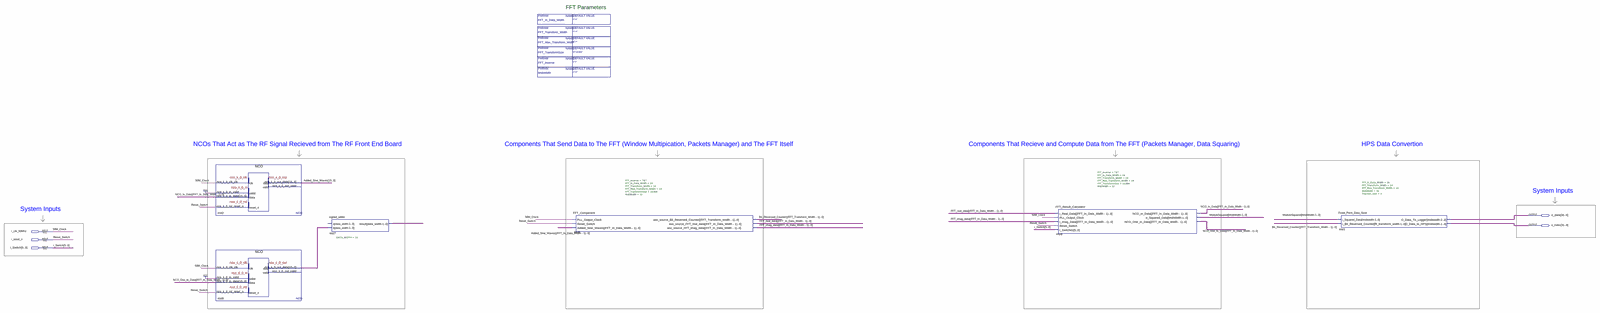
[diagram p0: schematic sheet, whole]
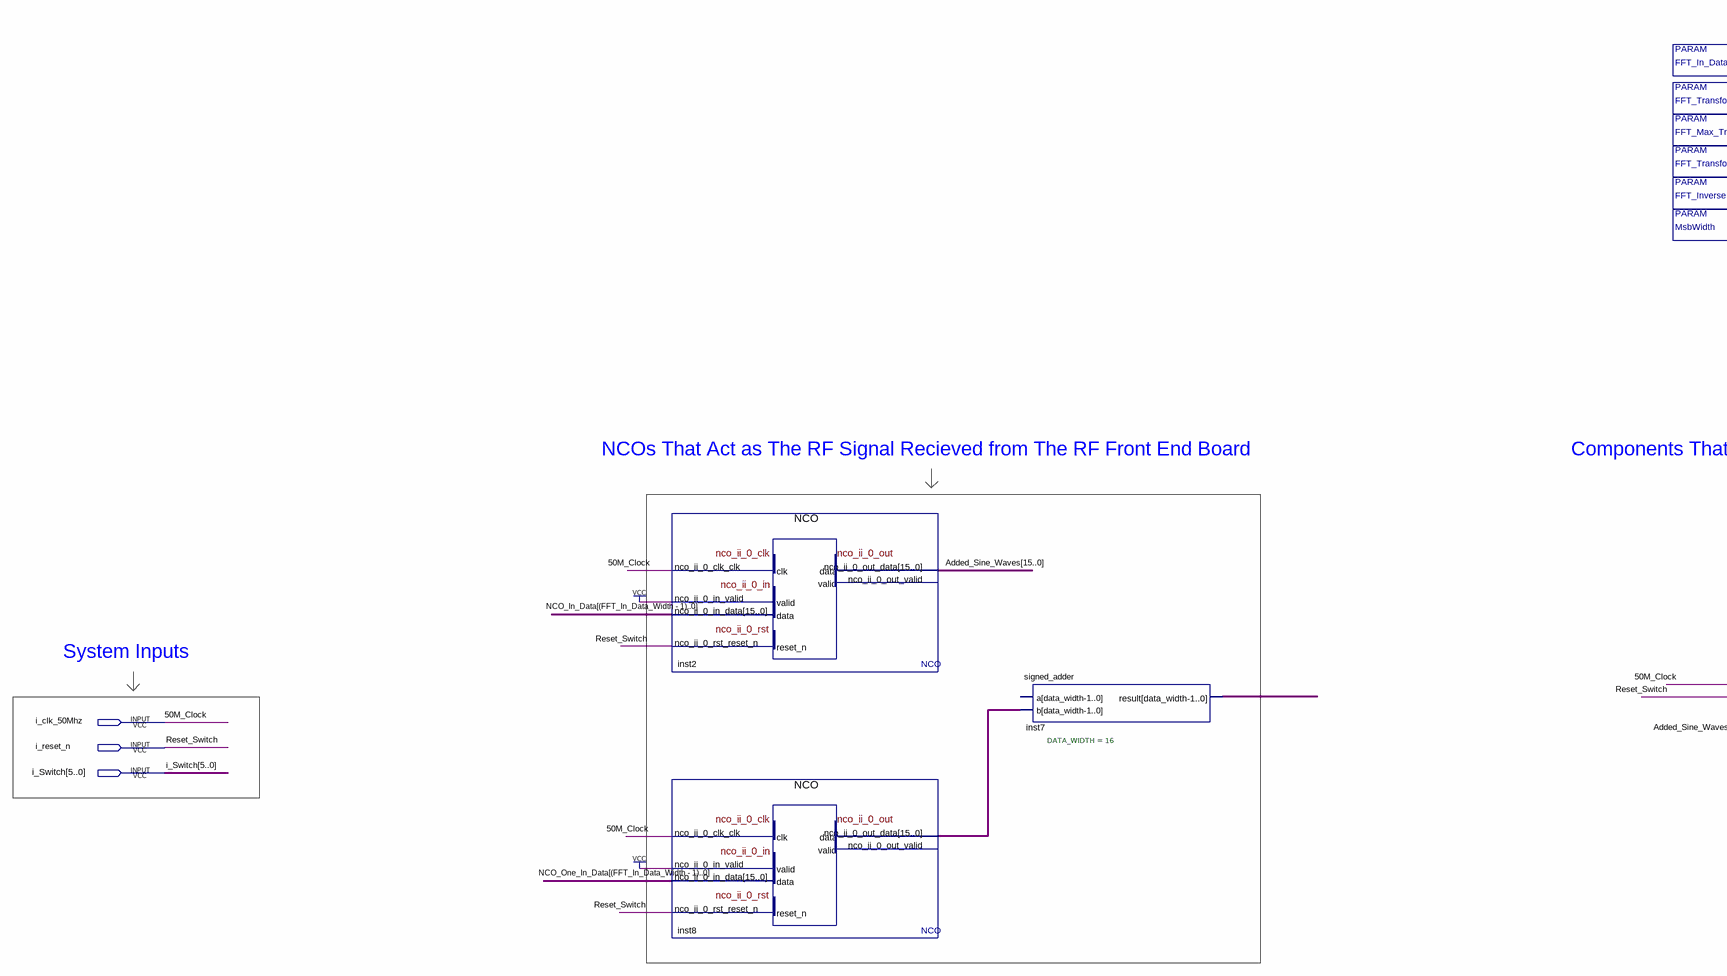
[diagram p1: schematic sheet, left part]
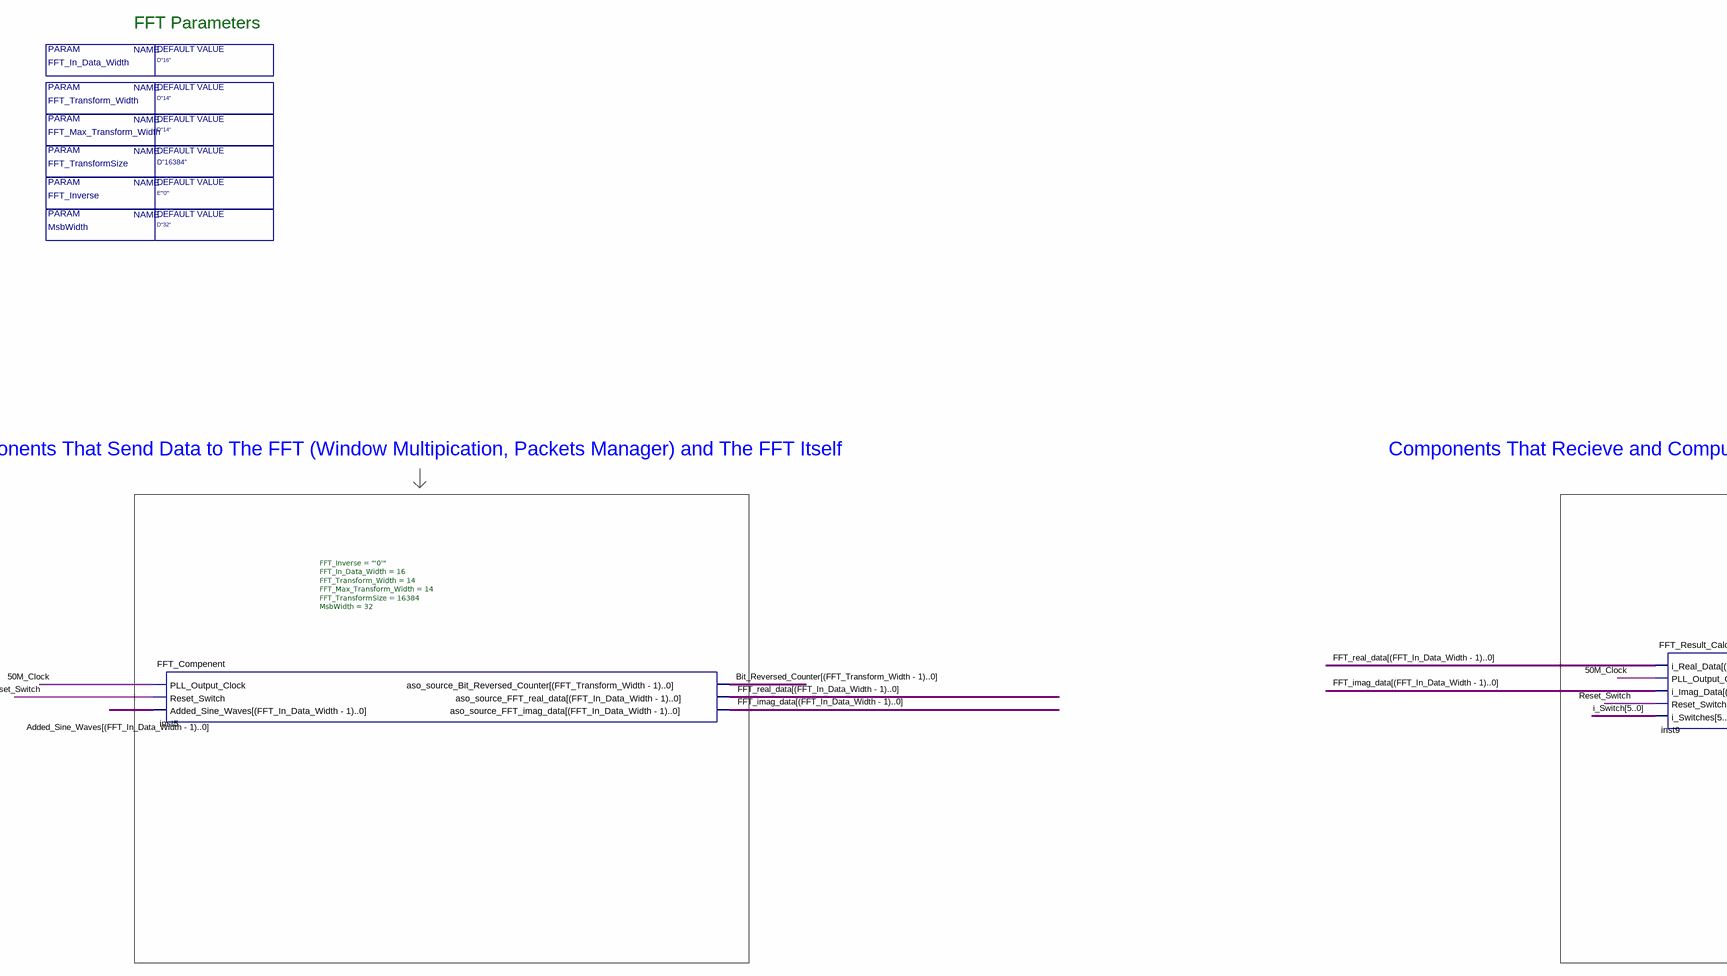
[diagram p2: schematic sheet, centre part]
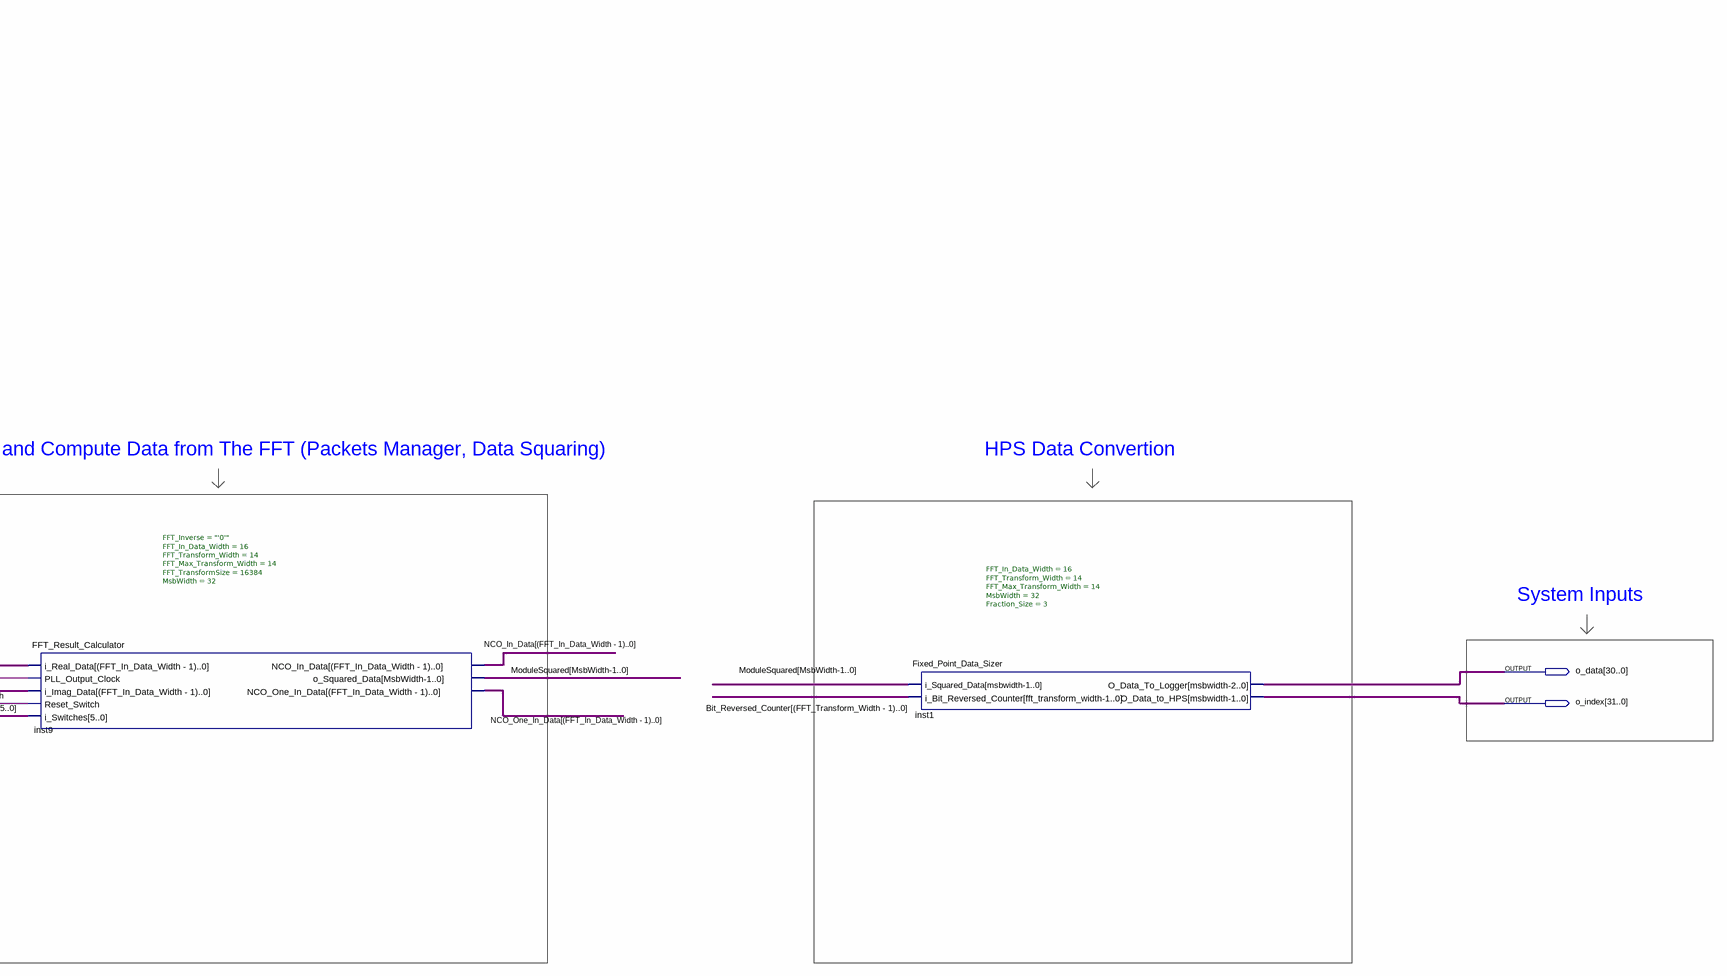
[diagram p3: schematic sheet, right part]
// Quartus schematic FFT_main.bdf as structural Verilog: 6 symbols, 5 pins
module FFT_main #(parameter FFT_Inverse = "E\"'0'\"", parameter FFT_In_Data_Width = "D\"16\"", parameter FFT_Transform_Width = "D\"14\"", parameter FFT_Max_Transform_Width = "D\"14\"", parameter FFT_TransformSize = "D\"16384\"", parameter MsbWidth = "D\"32\"") (
  input  i_clk_50Mhz,
  input  i_reset_n,
  input  [5:0] i_Switch,
  output [30:0] o_data,
  output [31:0] o_index
);

  wire \Added_Sine_Waves[(FFT_In_Data_Width_-_1)..0] , \Bit_Reversed_Counter[(FFT_Transform_Width_-_1)..0] ,
       \FFT_imag_data[(FFT_In_Data_Width_-_1)..0] , \FFT_real_data[(FFT_In_Data_Width_-_1)..0] ,
       \ModuleSquared[MsbWidth-1..0] , \NCO_In_Data[(FFT_In_Data_Width_-_1)..0] ,
       \NCO_One_In_Data[(FFT_In_Data_Width_-_1)..0] ;
  wire [15:0] Added_Sine_Waves, inst7_result, inst8_nco_ii_0_out_data;

  NCO inst2 (
    .nco_ii_0_clk_clk(i_clk_50Mhz), .nco_ii_0_in_valid(1'b1),
    .nco_ii_0_in_data({16{\NCO_In_Data[(FFT_In_Data_Width_-_1)..0] }}), .nco_ii_0_rst_reset_n(i_reset_n),
    .nco_ii_0_out_data(Added_Sine_Waves));  // open: nco_ii_0_out_valid
  NCO inst8 (
    .nco_ii_0_clk_clk(i_clk_50Mhz), .nco_ii_0_in_valid(1'b1),
    .nco_ii_0_in_data({16{\NCO_One_In_Data[(FFT_In_Data_Width_-_1)..0] }}), .nco_ii_0_rst_reset_n(i_reset_n),
    .nco_ii_0_out_data(inst8_nco_ii_0_out_data));  // open: nco_ii_0_out_valid
  signed_adder #(.DATA_WIDTH(16)) inst7 (.b(inst8_nco_ii_0_out_data), .result(inst7_result));  // open: a
  FFT_Compenent #(.FFT_Inverse("'0'"), .FFT_In_Data_Width(16), .FFT_Transform_Width(14), .FFT_Max_Transform_Width(14), .FFT_TransformSize(16384), .MsbWidth(32)) inst5 (
    .PLL_Output_Clock(i_clk_50Mhz), .Reset_Switch(i_reset_n),
    .Added_Sine_Waves({16{\Added_Sine_Waves[(FFT_In_Data_Width_-_1)..0] }}),
    .aso_source_Bit_Reversed_Counter(\Bit_Reversed_Counter[(FFT_Transform_Width_-_1)..0] ),
    .aso_source_FFT_real_data(\FFT_real_data[(FFT_In_Data_Width_-_1)..0] ),
    .aso_source_FFT_imag_data(\FFT_imag_data[(FFT_In_Data_Width_-_1)..0] ));
  FFT_Result_Calculator #(.FFT_Inverse("'0'"), .FFT_In_Data_Width(16), .FFT_Transform_Width(14), .FFT_Max_Transform_Width(14), .FFT_TransformSize(16384), .MsbWidth(32)) inst9 (
    .i_Real_Data({16{\FFT_real_data[(FFT_In_Data_Width_-_1)..0] }}), .PLL_Output_Clock(i_clk_50Mhz),
    .i_Imag_Data({16{\FFT_imag_data[(FFT_In_Data_Width_-_1)..0] }}), .Reset_Switch(i_reset_n),
    .i_Switches(i_Switch), .NCO_In_Data(\NCO_In_Data[(FFT_In_Data_Width_-_1)..0] ),
    .o_Squared_Data(\ModuleSquared[MsbWidth-1..0] ),
    .NCO_One_In_Data(\NCO_One_In_Data[(FFT_In_Data_Width_-_1)..0] ));
  Fixed_Point_Data_Sizer #(.FFT_In_Data_Width(16), .FFT_Transform_Width(14), .FFT_Max_Transform_Width(14), .MsbWidth(32), .Fraction_Size(3)) inst1 (
    .i_Squared_Data({32{\ModuleSquared[MsbWidth-1..0] }}),
    .i_Bit_Reversed_Counter({14{\Bit_Reversed_Counter[(FFT_Transform_Width_-_1)..0] }}),
    .O_Data_To_Logger(o_data), .O_Data_to_HPS(o_index));

  // Other names for the same wires on the sheet: 50M_Clock = i_clk_50Mhz; Reset_Switch = i_reset_n

  // Notes on the sheet:
  //   FFT Parameters
  //   NCOs That Act as The RF Signal Recieved from The RF Front End Board       
  //   Components That Send Data to The FFT (Window Multipication, Packets Manager) and The FFT Itself          
  //   Components That Recieve and Compute Data from The FFT (Packets Manager, Data Squaring)          
  //   HPS Data Convertion   
  //   System Inputs   
  //   System Inputs   
endmodule
